# EAGLE design Adafruit Ultimate GPS USB-C (EAGLE 9.6.2)
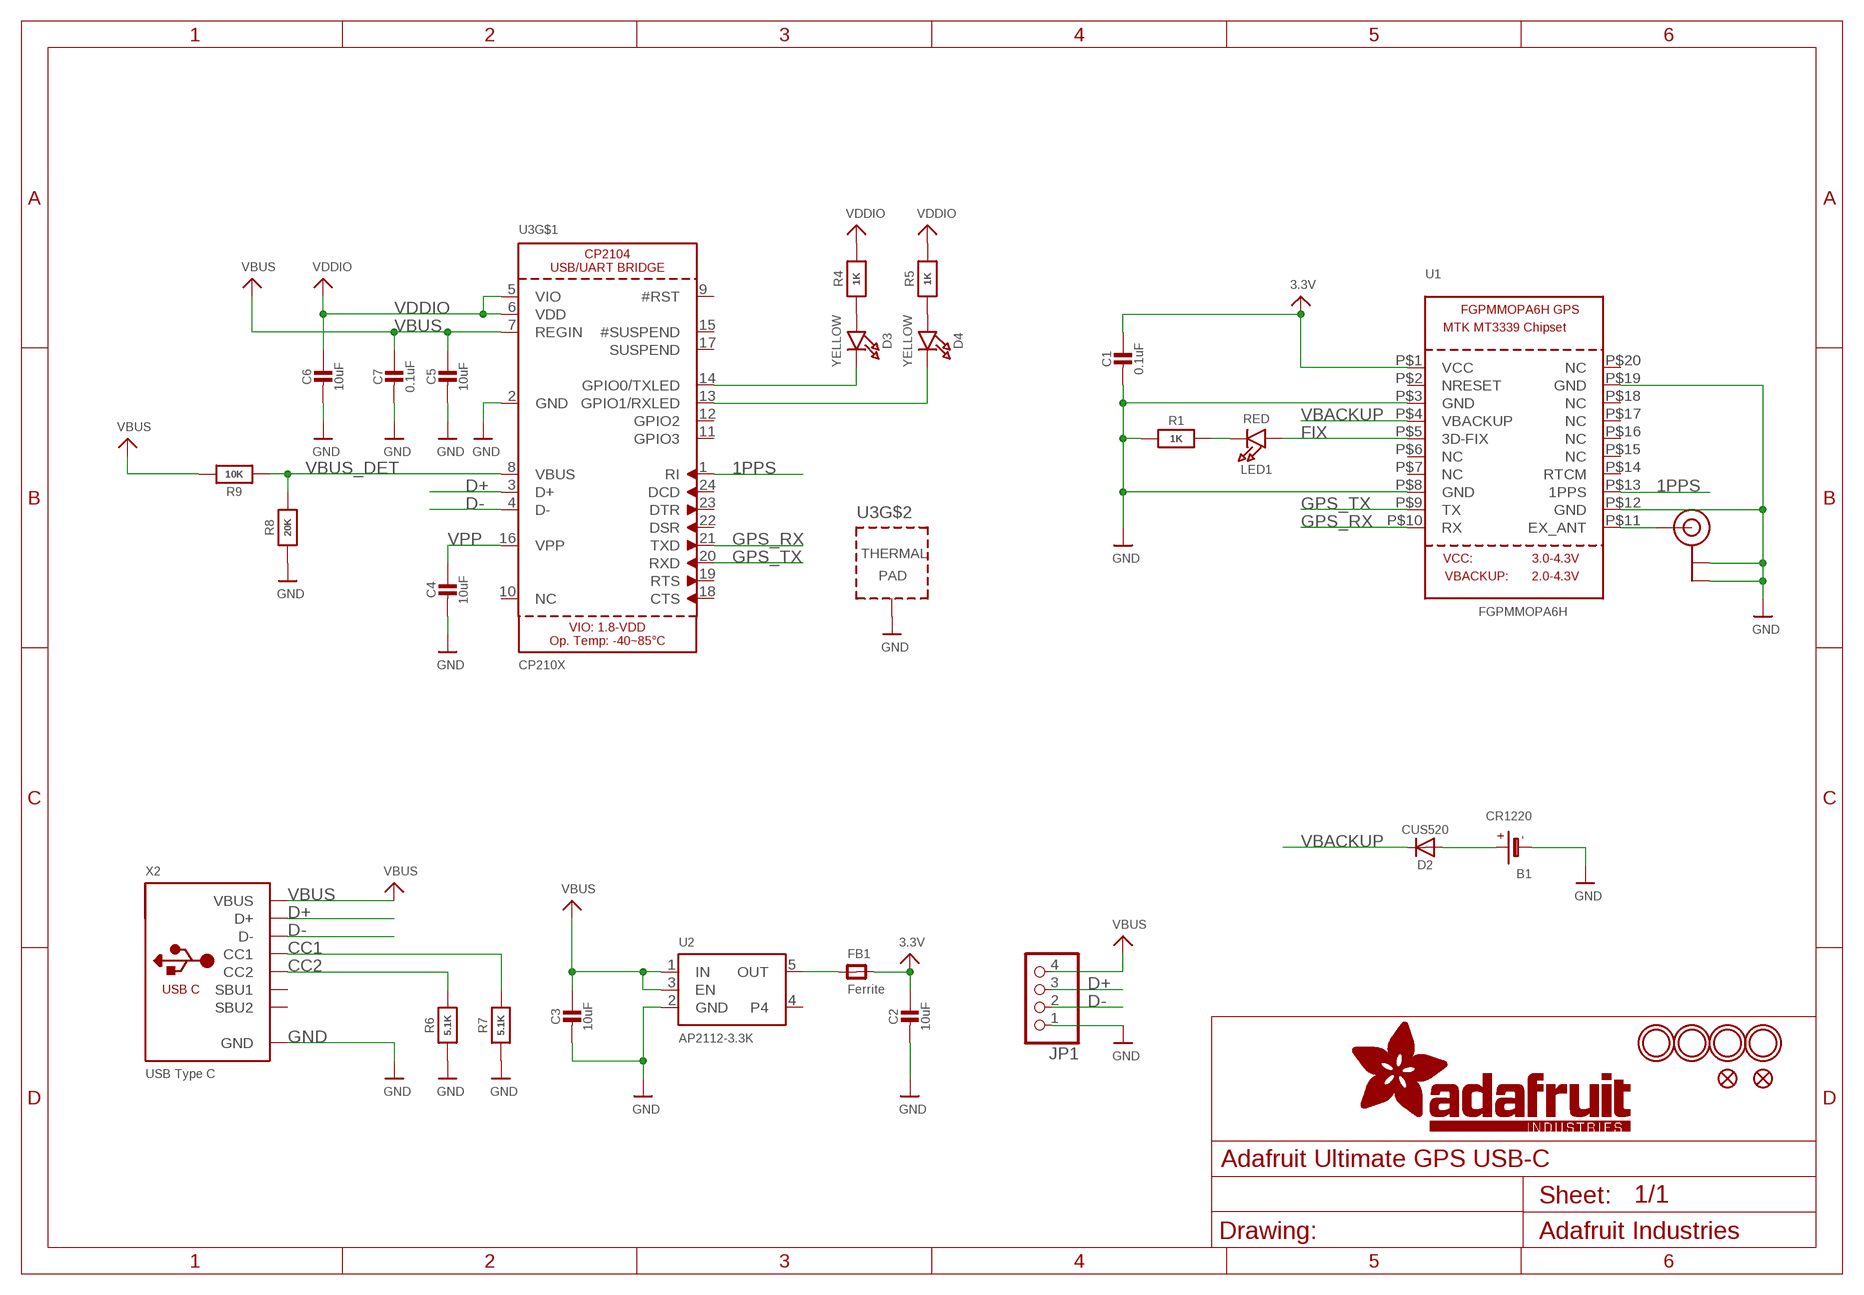
[diagram p0: schematic, sheet 1]

## Parts
B1  CR1220  BATTERYCR1220_SMT  [CR1220]
C1  0.1uF  CAP_CERAMIC0603_NO  [0603-NO]
C2  10uF  CAP_CERAMIC0805-NOOUTLINE  [0805-NO]
C3  10uF  CAP_CERAMIC0805-NOOUTLINE  [0805-NO]
C4  10uF  CAP_CERAMIC0805-NOOUTLINE  [0805-NO]
C5  10uF  CAP_CERAMIC0805-NOOUTLINE  [0805-NO]
C6  10uF  CAP_CERAMIC0805-NOOUTLINE  [0805-NO]
C7  0.1uF  CAP_CERAMIC0603_NO  [0603-NO]
D2  CUS520  DIODESOD-323  [SOD-323]
D3  YELLOW  LED0805_NOOUTLINE  [CHIPLED_0805_NOOUTLINE]
D4  YELLOW  LED0805_NOOUTLINE  [CHIPLED_0805_NOOUTLINE]
FB1  Ferrite  FERRITE-0805NO  [0805-NO]
FID1  FIDUCIAL_1MM  [FIDUCIAL_1MM]
FID2  FIDUCIAL_1MM  [FIDUCIAL_1MM]
JP1  HEADER-1X4ROUND  [1X04_ROUND]
LED1  RED  LED0805_NOOUTLINE  [CHIPLED_0805_NOOUTLINE]
R1  1K  RESISTOR_0603_NOOUT  [0603-NO]
R4  1K  RESISTOR_0603_NOOUT  [0603-NO]
R5  1K  RESISTOR_0603_NOOUT  [0603-NO]
R6  5.1K  RESISTOR_0603_NOOUT  [0603-NO]
R7  5.1K  RESISTOR_0603_NOOUT  [0603-NO]
R8  20K  RESISTOR_0603_NOOUT  [0603-NO]
R9  10K  RESISTOR_0603_NOOUT  [0603-NO]
U1  FGPMMOPA6H  GPS_FGPMMOPA6H  [FGPMMOPA6H]
U2  AP2112-3.3K  VREG_SOT23-5  [SOT23-5]
U3  CP210X  CP2104  [QFN24_4MM_SMSC]
U$8  MOUNTINGHOLE2.5  [MOUNTINGHOLE_2.5_PLATED]
U$9  MOUNTINGHOLE2.5  [MOUNTINGHOLE_2.5_PLATED]
U$20  U.FL  [U.FL]
U$35  MOUNTINGHOLE2.5  [MOUNTINGHOLE_2.5_PLATED]
U$36  MOUNTINGHOLE2.5  [MOUNTINGHOLE_2.5_PLATED]
X2  USB Type C  USB_C  [USB_C_CUSB31-CFM2AX-01-X]

## Nets
1PPS: U1.P$13(1PPS) U3.1(RI)
3.3V: C1.1 C2.1 FB1.2 U1.P$1(VCC)
CC1: R7.2 X2.A5(CC1)
CC2: R6.2 X2.B5(CC2)
D+: JP1.3 U3.3(D+) X2.A6(D+) X2.B6(D+)
D-: JP1.2 U3.4(D-) X2.A7(D-) X2.B7(D-)
FIX: LED1.A U1.P$5(3D-FIX)
GND: B1.- C1.2 C2.2 C3.2 C4.2 C5.2 C6.2 C7.2 JP1.1 R1.1 R6.1 R7.1 R8.1 U1.P$3(GND) U1.P$8(GND) U1.P$12(GND) U1.P$19(GND) U2.2(GND) U3.2(GND) U3.THERM(TP) U$20.P$1(GND) U$20.P$2(GND) X2.A1B12(GND) X2.B1A12(GND)
GPS_RX: U1.P$10(RX) U3.21(TXD)
GPS_TX: U1.P$9(TX) U3.20(RXD)
N$1: B1.+$1(+) B1.+$2(+) D2.A
N$2: LED1.C R1.2
N$3: FB1.1 U2.5(OUT)
N$4: U1.P$11(EX_ANT) U$20.P$3(SIGNAL)
N$8: D3.A R4.1
N$9: D4.A R5.1
N$10: D3.C U3.14(GPIO0/TXLED)
N$11: D4.C U3.13(GPIO1/RXLED)
VBACKUP: D2.C U1.P$4(VBACKUP)
VBUS: C3.1 C5.1 C7.1 JP1.4 R9.2 U2.1(IN) U2.3(EN) U3.7(REGIN) X2.A4B9(VBUS) X2.B4A9(VBUS)
VBUS_DET: R8.2 R9.1 U3.8(VBUS)
VDDIO: C6.1 R4.2 R5.2 U3.5(VIO) U3.6(VDD)
VPP: C4.1 U3.16(VPP)
Unconnected: U1.P$2(NRESET) U1.P$6(NC) U1.P$7(NC) U1.P$14(RTCM) U1.P$15(NC) U1.P$16(NC) U1.P$17(NC) U1.P$18(NC) U1.P$20(NC) U2.4 U3.9(#RST) U3.10(NC) U3.11(GPIO3) U3.12(GPIO2) U3.15(#SUSPEND) U3.17(SUSPEND) U3.18(CTS) U3.19(RTS) U3.22(DSR) U3.23(DTR) U3.24(DCD) X2.A8(SBU1) X2.B8(SBU2)

## Library data of the parts
B1 = microbuilder:BATTERY: CR1220 SMT - Digikey: 3001K-ND CD2032 BAT-HLD-001 - Digikey: BAT-HLD-001-ND
C1-C7 = microbuilder:CAP_CERAMIC: Ceramic Capacitors For new designs, use the packages preceded by an '_' character since they are more reliable: The following footprints should be used on most boards: _0402 - Standard footprint for regular board layouts _0603 - Standard footprint for regular board layouts _0805 - Standard footprint for regular board layouts _1206 - Standard footprint for regular board layouts For extremely tight-pitch boards where space is at a premium, the following 'micro-pitch' footprints can be used (smaller pads, no silkscreen outline, etc.): _0402MP - Micro-pitch footprint for very dense/compact boards _0603MP - Micro-pitch footprint for very dense/compact boards _0805MP - Micro-pitch footprint for very dense/compact boards _1206MP - Micro-pitch footprint for very dense/compact boards
D2 = microbuilder:DIODE: Diode SMA Model Volts Amps Type Vf Ir Digikey # Notes SSA34-E3 40V 3A Schottky 480mV @ 3A 200uA @ 40V SSA34-E3/61TGITR-ND CDBA120-G 20V 1A Schottky 500mV @ 1A 500uA @ 20V 641-1014-6-ND REEL MBRA210 10V 2A Schottky 350mV @ 2A 700uA @ 10V MBRA210LT3 SOD-123 Model Volts Amps Type Vf Ir Order # Notes BAT54T1G 30V 200mA Schottky 800mV @ 200mA 2uA @ 25V BAT54T1GOSTR-ND B0530W 30V 500mA Schottky 430mV @ 500mA 130uA @ 30V B0530W-FDICT-ND REEL MBR120 20V 1A Schottky 340mV @ 1A MBR120VLSFT1GOSCT-ND SOD-323 Model Volts Amps Type Vf Ir Order # Notes PMEG2005EJ 20V 500mA Schottky 355mV @ 500mA 568-4110-1-ND ZLLS410 10V 570mA Schottky 380mV @ 570mA ZLLS410CT-ND 1N4148WS 75V 150mA Silicon/Simple 1V 1N4148WSFSCT-ND REEL SOD-523 Model Volts Amps Type Vf Ir Order # Notes BAT54XV2 30V 200mA Schottky 0.8V @ 100mA BAT54XV2CT-ND TB751S 30V 30mA Schottky RB751S-40TE61CT-ND SOT23-R/W (R = Solder Paste/Reflow Ovens, W = Hand-Soldering) Model Volts Amps Type Vf Ir Order # Notes BAT54FILM 40V 300mA Schottky 497-7162-1-ND POWERDI-5 Model Volts Amps Type Vf Ir Order # Notes PDS560 60V 5A Schottky 670mV @ 5A 150uA @ 60V PDS560DICT-ND
D3 D4 LED1 = microbuilder:LED: LED 0603 - 0603 Surface Mount Package 2mA: Green LED - Low Power (3.9mcd, 2ma, 1.7Vf) - Digikey: 475-2709-2-ND Orange LED - Low Power (9.8mcd, 2ma, 1.8Vf) - Digikey: 475-1194-2-ND Red LED - Low Power (5mcd, 2ma, 1.8Vf) - Digikey: 475-1195-2-ND Yellow LED - Low Power (7mcd, 2ma, 1.8Vf) - Digikey: 475-1196-2-ND 5mA: Blue LED - Low Power (17mcd, 5ma, 2.9Vf) - Digikey: LNJ937W8CRACT-ND 0805 - 0805 Surface Mount Package 2mA: Red LED (8.8mcd, 2mA, 1.8Vf, Clear) - Low Power [Digikey: 475-2510-1-ND] Green LED (5mcd, 2mA, 1.8Vf, Clear) - Low Power [Digikey: 475-2730-1-ND] Yellow LED (11.3mcd, 2mA, 1.8Vf, Clear) - Low Power [Digikey: 475-2555-1-ND] 20mA: Red LED (104mcd, 20mA, Diffused) - LS R976 [Digikey: 475-1278-6-ND] Red LED (12mcd, 20mA, 2.0Vf, Clear) - APT2012EC [Digikey: 754-1128-1-ND] Green LED (15mcd, 20mA, 2.2Vf, Clear) - APT2012GC [Digikey: 754-1131-1-ND] Orange LED (160mcd, 20mA, 2.1Vf, Clear) - APT2012SECK [Digikey: 754-1130-1-ND] 1206 - 1206 Surface Mount Package Green LED (26mcd, 20mA, Diffused) - LG N971 [Digikey: 475-1407-6-ND] Red LED (15mcd, 20mA, Diffused) - LH N974 [Digikey: 475-1416-6-ND] Cree - Cree High-Power Surface Mount LEDs XPEBWT-L1-0000-00D50 - White 111lm 350mA 2.9Vf 6200K 110° XTEAWT-00-0000-00000LEE3 - White 114lm 350mA 2.85Vf 5000K 115° Everlight - Everlight 45-21 Series Surface Mount LEDs 45-21/QK2C-B2832AC2CB2/2T - Warm White 2000mcd 20mA 3.25Vf 3050K 120° 45-21/LK2C-B38452C4CB2/2T - Nuetral White 2000mcd 20mA 3.25Vf 4150K 120° 45-21/LK2C-B50634C6CB2/2T - Cold White 2200mcd 20mA 3.25Vf 5650K 120° PLCC2 Reverse Mount LS T77K-J1L2-1-0-2-R18-Z - Red 11.25mcd 2mA 1.8Vf 630nm 120° LO T77K-L1M2-24-Z - Orange 19.6mcd 2mA 1.8Vf 606nm 120° LY T77K-K2M1-26-Z - Yellow 15.7mcd 2mA 1.8Vf 587nm 120°
FB1 = microbuilder:FERRITE: Ferrite Bead 0603 MMZ1608B121C - 120 Ohm @ 100MHz, 600mA, 0.15 Ohm DC Resistance - Digikey: 445-2164-1-ND BK1608HW121-T - 120 Ohm, 600mA Ferrite Chip - Digikey: 587-1876-2-ND 0805 HZ0805B272R-10 - 2.7K Ohm @ 100MHz, 200mA, 0.8 Ohm DC Resistance - Digikey: 240-2504-1-ND (see also Murata BLM21BD272SN1L) MMZ2012Y152B - 1.5K Ohm @ 100MHz, 500mA, 0.4 Ohm DC Resistance - Digikey: 445-1560-1-ND - Mainly for high frequency (80-400MHz) MMZ2012R102A - 1K Ohm @ 100MHz, 500mA, 0.3 Ohm DC Resistance - Digikey: 445-1555-2-ND - More general purpose (10-200MHz)
FID1 FID2 = microbuilder:FIDUCIAL: Fiducial Alignment Points Various fiducial points for machine vision alignment.; BOM: EXCLUDE
JP1 = microbuilder:HEADER-1X4: PIN HEADER
R1 R4-R9 = microbuilder:RESISTOR: Resistors For new designs, use the packages preceded by an '_' character since they are more reliable: The following footprints should be used on most boards: _0402 - Standard footprint for regular board layouts _0603 - Standard footprint for regular board layouts _0805 - Standard footprint for regular board layouts _1206 - Standard footprint for regular board layouts For extremely tight-pitch boards where space is at a premium, the following 'micro-pitch' footprints can be used (smaller pads, no silkscreen outline, etc.): _0402MP - Micro-pitch footprint for very dense/compact boards _0603MP - Micro-pitch footprint for very dense/compact boards _0805MP - Micro-pitch footprint for very dense/compact boards _1206MP - Micro-pitch footprint for very dense/compact boards
U1 = microbuilder:GPS_FGPMMOPA6H: GPS Module - MTK MT3339 Chipset, -165dBm sensitivity, 22 channels, 10Hz, auto-select external antenna options
U2 = microbuilder:VREG_SOT23-5: SOT23-5 Fixed Voltage Regulators Part Current Out V Out V In V Dropout θJA (°C/W) TJ (°C) Digikey Part No. ADP121 150mA 3.3V 3.4-5.5V 0.09V @ 150mA -- -- ADP121-AUJZ33R7CT-ND ADP121 150mA 3.0V 3.1-5.5V 0.09V @ 150mA -- -- ADP121-AUJZ30R7CT-ND ADP122 300mA 3.3V 3.4-5.5V 0.085V @ 300mA -- -- ADP122AUJZ-3.3-R7CT-ND ADP1712 300mA 3.3V 3.5-5.5V 0.17V @ 300mA -- -- ADP1712AUJZ-3.3-R7TR-ND AP7311 (Low Cost) 150mA 3.3V 3.5-6V 0.15V @ 150mA -- -- AP7311-33WG-7DICT-ND LD39015M18R 150mA 1.8V 1.9V-5.5V 0.08V @ 100mA -- -- 497-6977-1-ND LP2985A-33DBVR 150mA 3.3V 3.3-16V 0.28V @ 150mA 206 150 296-18479-1-ND MCP1824T-3302E/OT 300mA 3.3V 3.5V-6V 0.2V @ 300mA -- -- MCP1824T-3302E/OTCT-ND MIC5205-2.5YM5 TR 150mA 2.5V 2.7-16V 0.165V @ 150mA -- -- 576-1257-2-ND MIC5205-3.0YM5 TR 150mA 3.0V 3.2V-16V 0.165V @ 150mA -- -- 576-1258-2-ND MIC5205-3.3YM5 TR 150mA 3.3V 3.5V-16V 0.165V @ 150mA -- -- 576-1259-2-ND TPS780330220 150mA 3.3V+2.2V 3.6-5.5V 250mV Max -- -- 296-23332-1-ND TDA3663/N1,135 100mA 3.3V 3.5-45V 0.18V @ 50mA -- -- 568-5343-1-ND Max operating temp can be calculated using θJA, TJ (max junction temperature), and power in watts. Set the "Maximum Ambient Temperature" until it reaches TJ ("Max Junction Temperature"), which is the absolute limit for safe use of the regulator: Heat Sink Temperature Calculator <http://www.daycounter.com/Calculators/Heat-Sink-Temperature-Calculator.phtml> For example, With 12V source into a 3.3V LP2985 and a 30mA load, we are dissipating (12V-3.3V) * 0.03A = 0.261W. With a θJA of 206 °C/W, a TJ of 150°C, and 261mW we can safely use the chip without a heat sink up to 75°C (=147.1°C Junction Temperature).
U3 = microbuilder:CP2104: CP2104 - USB to UART Bridge VDD Output: 3.45V
U$8 U$9 U$35 U$36 = microbuilder:MOUNTINGHOLE: Mounting Hole For #2 screws (0.086"/2.18mm width, 0.094"/2.4mm hole) use 2.5mm; BOM: EXCLUDE
U$20 = microbuilder:U.FL: U.FL Antenna Connector
X2 = adafruit_electromech:USB_C: USB Type-C USB 2.0 Connector

## Board
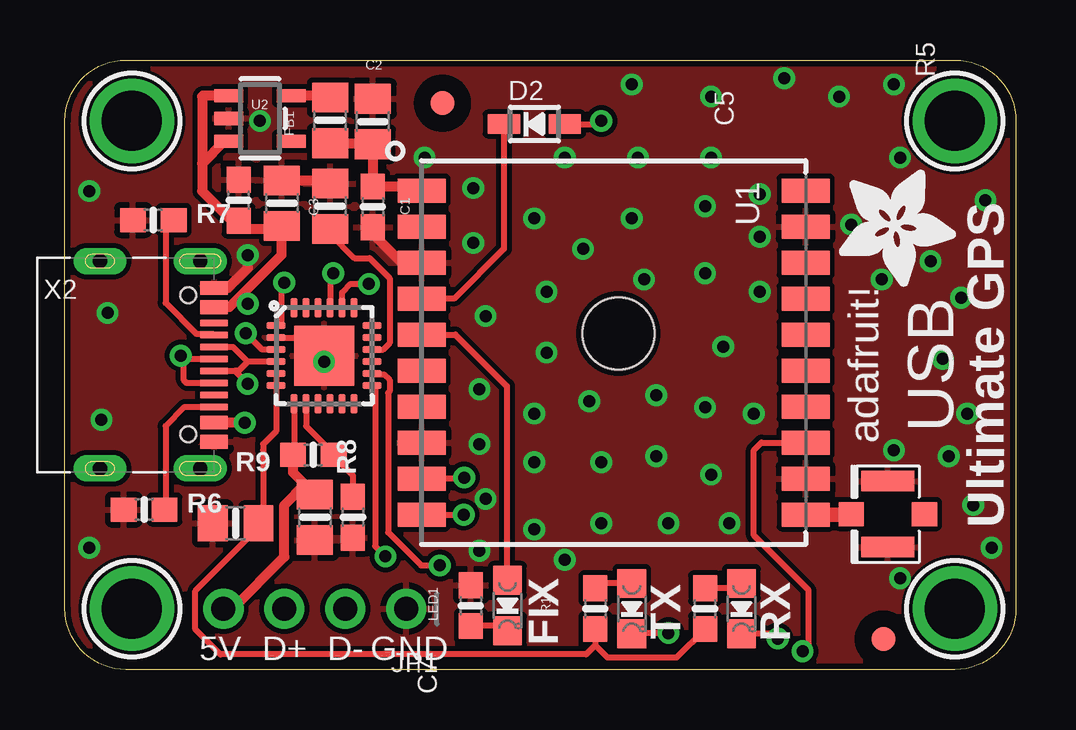
[diagram p1: board, top side]
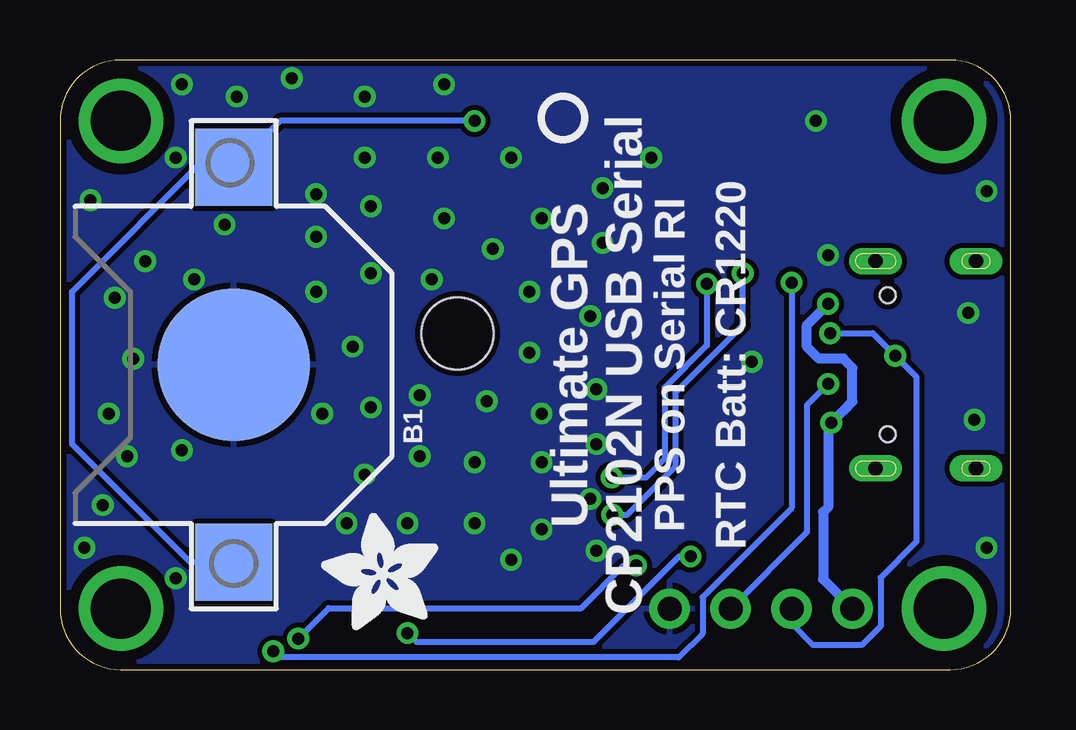
[diagram p2: board, bottom side, seen from below]

Size 39.62 x 25.4 mm. Coordinates in mm from the lower left corner, seen from the top.
Outline: 2.54,25.4 37.08,25.4 arc-90 39.62,22.86 39.62,2.54 arc-90 37.08,0 2.54,0 arc-90 0,2.54 0,22.86 arc-90 2.54,25.4
Copper layers (1*16): Top 0.035mm / dielectric 1.5mm / Bottom 0.035mm
Design rules "adafruit": minimum track width 8mil, minimum drill 15.5mil, track to track 8mil, track to pad 8mil, pad to pad 8mil, via to via 8mil, smd to smd 8mil, copper to edge 10mil, drill to drill 8mil, minimum pad ring 10mil, minimum via ring 8mil, stop-mask expansion 2mil, vias tented up to drill 20mil, thermal gap 10mil
bRestrict: area 7.1,6.4 to 7.6,6.5

### Footprints (pad centres in the part's own frame; a part is rotated, then mirrored left to right if it is on the bottom)
CR1220 = smd 3.2 x 3.2: +$1 -8.225,0; +$2 8.225,0 | smd 6.35 x 6.35: - 0,0
0603-NO = smd 1.075 x 1: 1 -0.85,0; 2 0.85,0
0805-NO = smd 1.24 x 1.5: 1 -0.95,0; 2 0.95,0
SOD-323 = smd 1.35 x 0.8: A 1.27,0; C -1.27,0
CHIPLED_0805_NOOUTLINE = smd 1.2 x 1.2: A 0,-1.05; C 0,1.05
FIDUCIAL_1MM = smd 1 x 1: 1 0,0
1X04_ROUND = drill 1 pad 1.676: 1 -3.81,0; 2 -1.27,0; 3 1.27,0; 4 3.81,0
FGPMMOPA6H = smd 2 x 1: P$1 -8,6.75; P$2 -8,5.25; P$3 -8,3.75; P$4 -8,2.25; P$5 -8,0.75; P$6 -8,-0.75; P$7 -8,-2.25; P$8 -8,-3.75; P$9 -8,-5.25; P$10 -8,-6.75; P$11 8,-6.75; P$12 8,-5.25; P$13 8,-3.75; P$14 8,-2.25; P$15 8,-0.75; P$16 8,0.75; P$17 8,2.25; P$18 8,3.75; P$19 8,5.25; P$20 8,6.75 | hole 3: 0.2,0.8
SOT23-5 = smd 0.55 x 1.2: 1 -0.95,-1.3; 2 0,-1.3; 3 0.95,-1.3; 4 0.95,1.3; 5 -0.95,1.3
QFN24_4MM_SMSC = smd 0.8 x 0.28: 1 -2,1.25; 2 -2,0.75; 3 -2,0.25; 4 -2,-0.25; 5 -2,-0.75; 6 -2,-1.25; 13 2,-1.25; 14 2,-0.75; 15 2,-0.25; 16 2,0.25; 17 2,0.75; 18 2,1.25 | smd 0.28 x 0.8: 7 -1.25,-2; 8 -0.75,-2; 9 -0.25,-2; 10 0.25,-2; 11 0.75,-2; 12 1.25,-2; 19 1.25,2; 20 0.75,2; 21 0.25,2; 22 -0.25,2; 23 -0.75,2; 24 -1.25,2 | smd 2.5 x 2.5: THERM 0,0
MOUNTINGHOLE_2.5_PLATED = drill 2.5 pad 3.2: P$1 0,0
U.FL = smd 2.2 x 0.85: P$1 0,1.375; P$2 0,-1.375 | smd 1.05 x 1: P$3 1.525,0; P$4 -1.525,0
USB_C_CUSB31-CFM2AX-01-X = smd 0.575 x 1.15: A1B12 -3.2,3.545; A4B9 -2.4,3.545; B1A12 3.2,3.545; B4A9 2.4,3.545 | smd 0.275 x 1.15: A5 -1.25,3.545; A6 -0.25,3.545; A7 0.25,3.545; A8 1.25,3.545; B5 1.75,3.545; B6 0.75,3.545; B7 -0.75,3.545; B8 -1.75,3.545 | drill 0.6 pad 1 long: M1 -4.32,2.97; M2 4.32,2.97; M3 -4.32,-1.21; M4 4.32,-1.21 | hole 0.65: 2.89,2.47; -2.89,2.47

### Placement (x,y rotation side)
B1  32.38,12.7 90 bottom
C1  12.83,19.28 270 top
C2  12.83,22.84 90 top
C3  9.04,19.43 90 top
C4  11.05,19.3 90 top
C5  10.41,6.35 270 top
C6  7.11,6.1 180 top
C7  7.24,19.56 90 top
D2  19.56,22.73 0 top
D3  28.19,2.54 180 top
D4  23.62,2.54 180 top
FB1  11.05,22.88 270 top
FID1  34.1,1.27 270 top
FID2  15.73,23.6 270 top
JP1  10.41,2.54 180 top
LED1  18.44,2.67 180 top
R1  16.91,2.67 270 top
R4  26.67,2.54 270 top
R5  22.1,2.54 270 top
R6  3.3,6.67 0 top
R7  3.68,18.73 0 top
R8  12,6.35 90 top
R9  10.35,8.95 180 top
U1  22.86,13.21 0 top
U2  8.13,22.96 270 top
U3  10.79,13.08 0 top
U$8  37.08,22.86 270 top
U$9  37.08,2.54 270 top
U$13  [ADAFRUIT_5MM]  32.26,20.83 270 top
U$16  [PCBFEAT-REV-040]  18.67,22.99 90 bottom
U$18  [ADAFRUIT_5MM]  23.88,1.65 90 bottom
U$20  34.29,6.48 180 top
U$35  2.79,2.54 270 top
U$36  2.79,22.86 270 top
X2  2.67,12.7 270 top

### Tracks (layer width: path | path; a pad name or v marks a point on that pad's centre or on a via)
1PPS  (via drill 0.5)
  Top 0.254: v30.73,0.76 30.99,0.76 30.99,3.3 28.7,5.59 28.7,9.14 29.02,9.46 U1.P$13 | U3.1 9.02,14.55 9.02,16 v9.14,16.13
  Bottom 0.254: v30.73,0.76 30.48,0.51 13.84,0.51 12.85,1.5 12.85,3.02 9.14,6.73 v9.14,16.13
3.3V
  Top 0.406: FB1.2 12.78,21.93 C2.1 C1.1 14.69,20.13 U1.P$1
CC1
  Top 0.254: X2.A5 6.18,13.98 5.5,13.98 4.2,15.28 4.2,18.4 R7.2
CC2
  Top 0.254: R6.2 4.2,6.71 4.2,10.15 4.19,10.16 4.98,10.95 X2.B5
D+  (via drill 0.5)
  Top 0.254: U3.3 8.22,13.33 v7.54,14.02 | v4.83,13.08 4.96,12.95 | 4.96,12.95 X2.A6 | X2.B6 6.2,11.94 5.08,11.94 4.96,12.06 4.96,12.95
  Bottom 0.254: v7.54,14.02 5.76,14.02 v4.83,13.08 3.94,12.19 3.94,5.33 5.44,3.83 5.44,1.8 6.22,1.02 8.26,1.02 9.14,1.91 JP1.3
D-  (via drill 0.5)
  Top 0.254: X2.A7 7.07,12.45 | 7.07,12.45 v7.61,11.9 | X2.B7 7,13.45 7.62,12.83 | 7.62,12.83 U3.4 | 7.62,12.83 7.24,12.45 7.07,12.45
  Bottom 0.254: JP1.2 8.5,5.72 8.5,11.02 v7.61,11.9
FIX
  Top 0.254: U1.P$5 16.27,13.96 18.41,11.81 18.41,3.74 LED1.A
GND  (via drill 0.5)
  Top 0.254: U3.2 10.04,13.83 U3.THERM
  Top 0.406: X2.A1B12 6.79,15.9 7.62,16.73 v7.62,17.27 | C3.2 10.35,20.38 10.54,20.19 10.99,20.19 C4.2 | C1.2 12.83,18.16 14.03,16.96 U1.P$3
  other vias: 14.99,21.34 17.02,20.07 17.02,17.78 17.53,14.73 17.27,11.68 17.27,9.4 17.53,7.11 28.96,19.81 28.96,18.03 28.96,15.75 28.7,10.67 27.69,6.1 32.77,18.54 34.54,9.14 36.83,8.89 34.8,3.81 38.61,5.08 37.59,10.67 36.58,12.95 34.04,16.26 36.07,17.02 34.54,24.38 32.26,23.88 29.97,24.64 26.92,23.88 23.62,24.38 23.88,21.34 26.92,21.34 26.67,19.3 26.67,16.51 27.43,13.46 26.67,10.92 26.92,8.13 25.15,6.1 24.64,8.89 24.64,11.43 24.13,16.26 23.62,18.8 20.83,21.34 19.56,18.8 21.59,17.53 20.07,15.75 20.07,13.21 21.84,11.18 22.35,8.64 22.35,6.1 19.56,5.84 19.56,8.64 19.56,10.67 17.27,4.95 37.34,15.49 37.85,6.86 38.35,19.56 34.8,21.34 20.83,4.57 8.13,22.86 1.78,14.86 1.52,10.41 1.02,19.94 1.02,5.08 10.79,12.83
  pour Top (isolate 0.203): 0,25.4 39.62,25.4 39.62,0 0,0
  pour Bottom (isolate 0.203): 0,25.4 39.62,25.4 39.62,0 0,0
GPS_RX  (via drill 0.5)
  Top 0.254: U1.P$10 v16.61,6.46 v16.61,6.45 | v11.18,16.51 11.04,16.38 U3.21
  Bottom 0.254: v16.61,6.45 15.98,6.45 13.97,8.46 13.97,11.56 11.18,14.35 v11.18,16.51
GPS_TX  (via drill 0.5)
  Top 0.254: U3.20 11.54,15.71 11.9,16.07 v12.67,16.07 | v16.64,8 16.59,7.96 U1.P$9
  Bottom 0.254: v12.67,16.07 12.67,13.51 14.43,11.75 14.43,8.78 15.21,8 v16.64,8
N$1  (via drill 0.5)
  Top 0.254: D2.A 22.23,22.73 v22.35,22.86
  Bottom 0.254: v22.35,22.86 30.45,22.86 31.99,21.32 | 31.99,21.32 B1.+$2 | B1.+$1 34.19,4.47 39.12,9.4 39.12,15.75 33.54,21.32 31.99,21.32
N$2
  Top 0.254: LED1.C 18.24,1.82 R1.2
N$3
  Top 0.406: FB1.1 10.97,23.91 U2.5
N$4
  Top 0.61: U1.P$11 32.75,6.46 U$20.P$3
N$8
  Top 0.254: D3.A 27.99,3.39 R4.1
N$9
  Top 0.254: D4.A 22.3,3.59 R5.1
N$10  (via drill 0.5)
  Top 0.254: v29.7,1.29 29.5,1.49 D3.C | U3.14 12.82,12.3 13.29,12.3 13.53,12.07 13.53,11.6 13.46,11.53 13.46,5.71 14.84,4.34 v15.62,4.34
  Bottom 0.254: v15.62,4.34 16.13,4.34 17.91,2.56 28.43,2.56 v29.7,1.29
N$11  (via drill 0.5)
  Top 0.254: D4.C 23.66,1.52 v25.15,1.52 | U3.13 12.92,11.7 12.92,5.15 v13.35,4.72
  Bottom 0.254: v25.15,1.52 24.77,1.14 17.4,1.14 13.83,4.72 v13.35,4.72
VBACKUP
  Top 0.254: D2.C 18.29,17.53 16.22,15.46 U1.P$4
VBUS  (via drill 0.5)
  Top 0.254: U3.7 9.54,9 R9.2
  Top 0.406: C3.1 9.02,18.48 9.02,18.35 | 9.02,18.35 7.59,18.35 C7.1 6.95,18.71 5.71,19.94 5.71,21.08 | U2.3 6.65,22.01 5.71,21.08 | 9.02,18.35 9.02,17.27 7.43,15.68 | X2.A4B9 6.85,15.1 7.43,15.68 | U2.1 5.75,23.91 5.71,23.88 5.71,21.08 | JP1.4 6.99,2.54 9.14,4.7 9.14,6.86 10,7.71 C5.1 9.5,8.21 R9.2 | X2.B4A9 v7.48,10.3 v7.49,10.29 | v7.62,15.24 7.62,15.49 7.43,15.68
  Bottom 0.406: v7.62,15.24 8.51,14.35 8.51,13.46 8,12.95 6.99,12.95 6.6,12.57 6.6,11.18 6.99,10.79 v7.49,10.29 7.62,10.16 7.62,6.76 7.82,6.56 7.82,3.76 JP1.4
VBUS_DET
  Top 0.254: U3.8 10.04,10.15 11.2,8.99 R9.1 11.2,8.89 12,8.09 R8.2
VDDIO
  Top 0.254: R5.2 22.1,1.02 | 22.1,1.02 22.61,0.51 25.49,0.51 R4.2 | U3.5 U3.6 8.79,9.94 8.26,9.4 8.26,9.14 8.26,6.83 C6.1 8.06,5.9 5.44,3.28 5.44,1.68 6.48,0.64 21.72,0.64 22.1,1.02
VPP
  Top 0.254: U3.16 13.26,13.33 13.53,13.6 13.53,16.32 12.7,17.14 12.06,17.14 11.05,18.16 C4.1

### Text on the board
tPlace: adafruit! | USB | Ultimate GPS | FIX | TX | RX | 5V | D+ | D- | GND
bPlace: RTC Batt: CR1220 | PPS on Serial RI | Ultimate GPS / CP2102N USB Serial